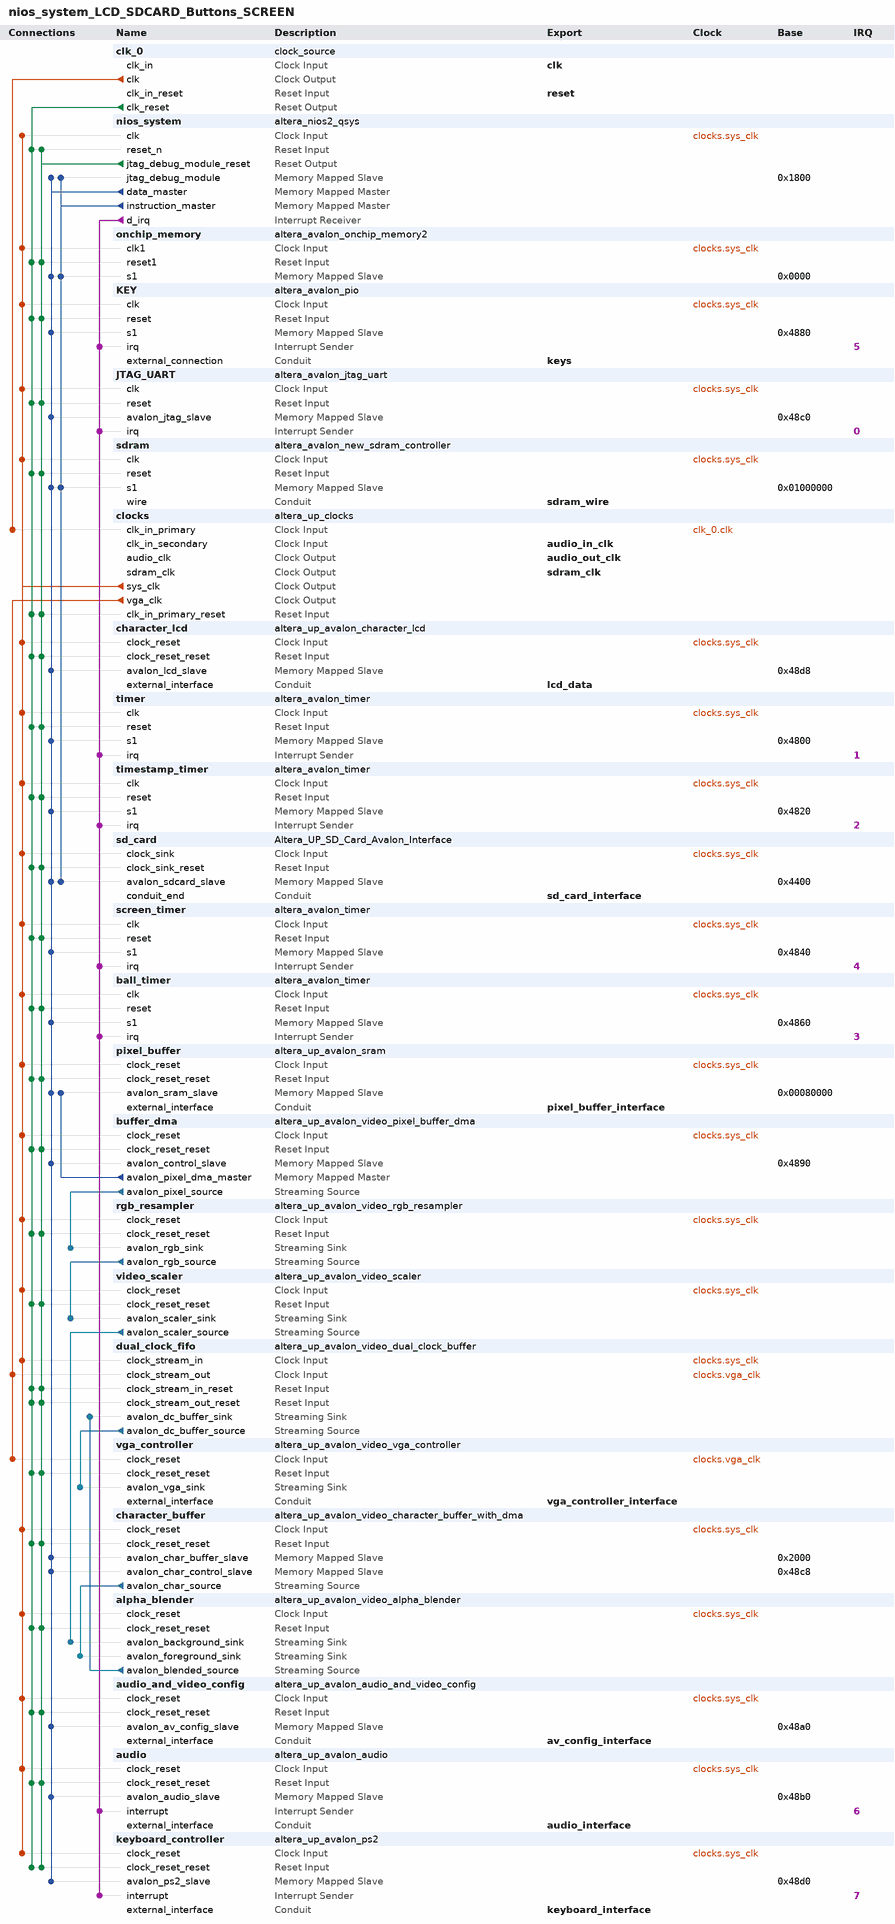
[diagram p0: system contents]
# Platform Designer (Qsys) system nios_system_LCD_SDCARD_Buttons_SCREEN, Cyclone II EP2C35F672C6
# Parameters at their usual value, and those the tool derives, are not listed.
package require -exact qsys 12.0
create_system nios_system_LCD_SDCARD_Buttons_SCREEN
set_project_property DEVICE_FAMILY {Cyclone II}
set_project_property DEVICE EP2C35F672C6

add_instance clk_0 clock_source 12.0
set_instance_parameter_value clk_0 clockFrequency 50000000

add_instance nios_system altera_nios2_qsys 12.0
set_instance_parameter_value nios_system resetSlave sdram.s1
set_instance_parameter_value nios_system exceptionSlave sdram.s1
set_instance_parameter_value nios_system breakSlave nios_system.jtag_debug_module
set_instance_parameter_value nios_system muldiv_multiplierType NoneSmall
set_instance_parameter_value nios_system impl Fast
set_instance_parameter_value nios_system icache_size 4096

add_instance onchip_memory altera_avalon_onchip_memory2 12.0
set_instance_parameter_value onchip_memory dataWidth 32
set_instance_parameter_value onchip_memory dualPort false
set_instance_parameter_value onchip_memory initMemContent true
set_instance_parameter_value onchip_memory initializationFileName onchip_memory
set_instance_parameter_value onchip_memory memorySize 4096

add_instance KEY altera_avalon_pio 12.0
set_instance_parameter_value KEY captureEdge true
set_instance_parameter_value KEY direction Input
set_instance_parameter_value KEY edgeType FALLING
set_instance_parameter_value KEY generateIRQ true
set_instance_parameter_value KEY irqType EDGE
set_instance_parameter_value KEY width 8

add_instance JTAG_UART altera_avalon_jtag_uart 12.0
set_instance_parameter_value JTAG_UART simInteractiveOptions INTERACTIVE_ASCII_OUTPUT

add_instance sdram altera_avalon_new_sdram_controller 12.0
set_instance_parameter_value sdram TAC 5.5
set_instance_parameter_value sdram TRCD 20.0
set_instance_parameter_value sdram TRP 20.0
set_instance_parameter_value sdram casLatency 3
set_instance_parameter_value sdram columnWidth 8
set_instance_parameter_value sdram dataWidth 16
set_instance_parameter_value sdram generateSimulationModel false
set_instance_parameter_value sdram model custom
set_instance_parameter_value sdram numberOfBanks 4
set_instance_parameter_value sdram numberOfChipSelects 1
set_instance_parameter_value sdram powerUpDelay 100.0
set_instance_parameter_value sdram refreshPeriod 15.625
set_instance_parameter_value sdram rowWidth 12

add_instance clocks altera_up_clocks 12.0
set_instance_parameter_value clocks board DE2
set_instance_parameter_value clocks vga_clk true
set_instance_parameter_value clocks audio_clk true
set_instance_parameter_value clocks audio_clk_freq 12.288

add_instance character_lcd altera_up_avalon_character_lcd 12.0
set_instance_parameter_value character_lcd cursor Normal

add_instance timer altera_avalon_timer 12.0
set_instance_parameter_value timer period 1
set_instance_parameter_value timer periodUnits MSEC
set_instance_parameter_value timer timerPreset FULL_FEATURED

add_instance timestamp_timer altera_avalon_timer 12.0
set_instance_parameter_value timestamp_timer period 1
set_instance_parameter_value timestamp_timer periodUnits MSEC
set_instance_parameter_value timestamp_timer timerPreset FULL_FEATURED

add_instance sd_card Altera_UP_SD_Card_Avalon_Interface 1.0

add_instance screen_timer altera_avalon_timer 12.0
set_instance_parameter_value screen_timer period 100
set_instance_parameter_value screen_timer periodUnits MSEC
set_instance_parameter_value screen_timer timerPreset FULL_FEATURED

add_instance ball_timer altera_avalon_timer 12.0
set_instance_parameter_value ball_timer period 200
set_instance_parameter_value ball_timer periodUnits MSEC
set_instance_parameter_value ball_timer timerPreset FULL_FEATURED

add_instance pixel_buffer altera_up_avalon_sram 12.0
set_instance_parameter_value pixel_buffer board DE2
set_instance_parameter_value pixel_buffer pixel_buffer true

add_instance buffer_dma altera_up_avalon_video_pixel_buffer_dma 12.0
set_instance_parameter_value buffer_dma addr_mode X-Y
set_instance_parameter_value buffer_dma start_address 0
set_instance_parameter_value buffer_dma back_start_address 0
set_instance_parameter_value buffer_dma image_width 320
set_instance_parameter_value buffer_dma image_height 240
set_instance_parameter_value buffer_dma color_space {16-bit RGB}

add_instance rgb_resampler altera_up_avalon_video_rgb_resampler 12.0
set_instance_parameter_value rgb_resampler input_type {16-bit RGB}
set_instance_parameter_value rgb_resampler output_type {30-bit RGB}
set_instance_parameter_value rgb_resampler alpha 1023

add_instance video_scaler altera_up_avalon_video_scaler 12.0
set_instance_parameter_value video_scaler width_scaling 2
set_instance_parameter_value video_scaler height_scaling 2
set_instance_parameter_value video_scaler width_in 320
set_instance_parameter_value video_scaler color_bits 10
set_instance_parameter_value video_scaler color_planes 3

add_instance dual_clock_fifo altera_up_avalon_video_dual_clock_buffer 12.0
set_instance_parameter_value dual_clock_fifo color_bits 10

add_instance vga_controller altera_up_avalon_video_vga_controller 12.0
set_instance_parameter_value vga_controller board DE2

add_instance character_buffer altera_up_avalon_video_character_buffer_with_dma 12.0
set_instance_parameter_value character_buffer enable_transparency true

add_instance alpha_blender altera_up_avalon_video_alpha_blender 12.0

add_instance audio_and_video_config altera_up_avalon_audio_and_video_config 12.0
set_instance_parameter_value audio_and_video_config board DE2
set_instance_parameter_value audio_and_video_config audio_in {Microphone to ADC}
set_instance_parameter_value audio_and_video_config line_in_bypass false
set_instance_parameter_value audio_and_video_config bit_length 24
set_instance_parameter_value audio_and_video_config sampling_rate {32 kHz}

add_instance audio altera_up_avalon_audio 12.0
set_instance_parameter_value audio avalon_bus_type {Memory Mapped}
set_instance_parameter_value audio audio_in true
set_instance_parameter_value audio dw 24

add_instance keyboard_controller altera_up_avalon_ps2 12.0

# connections
add_connection clk_0.clk clocks.clk_in_primary clock
add_connection clocks.sys_clk alpha_blender.clock_reset clock
add_connection clocks.sys_clk audio.clock_reset clock
add_connection clocks.sys_clk audio_and_video_config.clock_reset clock
add_connection clocks.sys_clk ball_timer.clk clock
add_connection clocks.sys_clk buffer_dma.clock_reset clock
add_connection clocks.sys_clk character_buffer.clock_reset clock
add_connection clocks.sys_clk character_lcd.clock_reset clock
add_connection clocks.sys_clk dual_clock_fifo.clock_stream_in clock
add_connection clocks.sys_clk JTAG_UART.clk clock
add_connection clocks.sys_clk KEY.clk clock
add_connection clocks.sys_clk keyboard_controller.clock_reset clock
add_connection clocks.sys_clk nios_system.clk clock
add_connection clocks.sys_clk onchip_memory.clk1 clock
add_connection clocks.sys_clk pixel_buffer.clock_reset clock
add_connection clocks.sys_clk rgb_resampler.clock_reset clock
add_connection clocks.sys_clk screen_timer.clk clock
add_connection clocks.sys_clk sd_card.clock_sink clock
add_connection clocks.sys_clk sdram.clk clock
add_connection clocks.sys_clk timer.clk clock
add_connection clocks.sys_clk timestamp_timer.clk clock
add_connection clocks.sys_clk video_scaler.clock_reset clock
add_connection clocks.vga_clk dual_clock_fifo.clock_stream_out clock
add_connection clocks.vga_clk vga_controller.clock_reset clock
add_connection clk_0.clk_reset alpha_blender.clock_reset_reset reset
add_connection clk_0.clk_reset audio.clock_reset_reset reset
add_connection clk_0.clk_reset audio_and_video_config.clock_reset_reset reset
add_connection clk_0.clk_reset ball_timer.reset reset
add_connection clk_0.clk_reset buffer_dma.clock_reset_reset reset
add_connection clk_0.clk_reset character_buffer.clock_reset_reset reset
add_connection clk_0.clk_reset character_lcd.clock_reset_reset reset
add_connection clk_0.clk_reset clocks.clk_in_primary_reset reset
add_connection clk_0.clk_reset dual_clock_fifo.clock_stream_in_reset reset
add_connection clk_0.clk_reset dual_clock_fifo.clock_stream_out_reset reset
add_connection clk_0.clk_reset JTAG_UART.reset reset
add_connection clk_0.clk_reset KEY.reset reset
add_connection clk_0.clk_reset keyboard_controller.clock_reset_reset reset
add_connection clk_0.clk_reset nios_system.reset_n reset
add_connection clk_0.clk_reset onchip_memory.reset1 reset
add_connection clk_0.clk_reset pixel_buffer.clock_reset_reset reset
add_connection clk_0.clk_reset rgb_resampler.clock_reset_reset reset
add_connection clk_0.clk_reset screen_timer.reset reset
add_connection clk_0.clk_reset sd_card.clock_sink_reset reset
add_connection clk_0.clk_reset sdram.reset reset
add_connection clk_0.clk_reset timer.reset reset
add_connection clk_0.clk_reset timestamp_timer.reset reset
add_connection clk_0.clk_reset vga_controller.clock_reset_reset reset
add_connection clk_0.clk_reset video_scaler.clock_reset_reset reset
add_connection nios_system.jtag_debug_module_reset alpha_blender.clock_reset_reset reset
add_connection nios_system.jtag_debug_module_reset audio.clock_reset_reset reset
add_connection nios_system.jtag_debug_module_reset audio_and_video_config.clock_reset_reset reset
add_connection nios_system.jtag_debug_module_reset ball_timer.reset reset
add_connection nios_system.jtag_debug_module_reset buffer_dma.clock_reset_reset reset
add_connection nios_system.jtag_debug_module_reset character_buffer.clock_reset_reset reset
add_connection nios_system.jtag_debug_module_reset character_lcd.clock_reset_reset reset
add_connection nios_system.jtag_debug_module_reset clocks.clk_in_primary_reset reset
add_connection nios_system.jtag_debug_module_reset dual_clock_fifo.clock_stream_in_reset reset
add_connection nios_system.jtag_debug_module_reset dual_clock_fifo.clock_stream_out_reset reset
add_connection nios_system.jtag_debug_module_reset JTAG_UART.reset reset
add_connection nios_system.jtag_debug_module_reset KEY.reset reset
add_connection nios_system.jtag_debug_module_reset keyboard_controller.clock_reset_reset reset
add_connection nios_system.jtag_debug_module_reset nios_system.reset_n reset
add_connection nios_system.jtag_debug_module_reset onchip_memory.reset1 reset
add_connection nios_system.jtag_debug_module_reset pixel_buffer.clock_reset_reset reset
add_connection nios_system.jtag_debug_module_reset rgb_resampler.clock_reset_reset reset
add_connection nios_system.jtag_debug_module_reset screen_timer.reset reset
add_connection nios_system.jtag_debug_module_reset sd_card.clock_sink_reset reset
add_connection nios_system.jtag_debug_module_reset sdram.reset reset
add_connection nios_system.jtag_debug_module_reset timer.reset reset
add_connection nios_system.jtag_debug_module_reset timestamp_timer.reset reset
add_connection nios_system.jtag_debug_module_reset vga_controller.clock_reset_reset reset
add_connection nios_system.jtag_debug_module_reset video_scaler.clock_reset_reset reset
add_connection buffer_dma.avalon_pixel_dma_master pixel_buffer.avalon_sram_slave avalon
set_connection_parameter_value buffer_dma.avalon_pixel_dma_master/pixel_buffer.avalon_sram_slave baseAddress 0x00080000
add_connection nios_system.data_master audio.avalon_audio_slave avalon
set_connection_parameter_value nios_system.data_master/audio.avalon_audio_slave baseAddress 0x48b0
add_connection nios_system.data_master audio_and_video_config.avalon_av_config_slave avalon
set_connection_parameter_value nios_system.data_master/audio_and_video_config.avalon_av_config_slave baseAddress 0x48a0
add_connection nios_system.data_master ball_timer.s1 avalon
set_connection_parameter_value nios_system.data_master/ball_timer.s1 baseAddress 0x4860
add_connection nios_system.data_master buffer_dma.avalon_control_slave avalon
set_connection_parameter_value nios_system.data_master/buffer_dma.avalon_control_slave baseAddress 0x4890
add_connection nios_system.data_master character_buffer.avalon_char_buffer_slave avalon
set_connection_parameter_value nios_system.data_master/character_buffer.avalon_char_buffer_slave baseAddress 0x2000
add_connection nios_system.data_master character_buffer.avalon_char_control_slave avalon
set_connection_parameter_value nios_system.data_master/character_buffer.avalon_char_control_slave baseAddress 0x48c8
add_connection nios_system.data_master character_lcd.avalon_lcd_slave avalon
set_connection_parameter_value nios_system.data_master/character_lcd.avalon_lcd_slave baseAddress 0x48d8
add_connection nios_system.data_master JTAG_UART.avalon_jtag_slave avalon
set_connection_parameter_value nios_system.data_master/JTAG_UART.avalon_jtag_slave baseAddress 0x48c0
add_connection nios_system.data_master KEY.s1 avalon
set_connection_parameter_value nios_system.data_master/KEY.s1 baseAddress 0x4880
add_connection nios_system.data_master keyboard_controller.avalon_ps2_slave avalon
set_connection_parameter_value nios_system.data_master/keyboard_controller.avalon_ps2_slave baseAddress 0x48d0
add_connection nios_system.data_master nios_system.jtag_debug_module avalon
set_connection_parameter_value nios_system.data_master/nios_system.jtag_debug_module baseAddress 0x1800
add_connection nios_system.data_master onchip_memory.s1 avalon
set_connection_parameter_value nios_system.data_master/onchip_memory.s1 baseAddress 0x0000
add_connection nios_system.data_master pixel_buffer.avalon_sram_slave avalon
set_connection_parameter_value nios_system.data_master/pixel_buffer.avalon_sram_slave baseAddress 0x00080000
add_connection nios_system.data_master screen_timer.s1 avalon
set_connection_parameter_value nios_system.data_master/screen_timer.s1 baseAddress 0x4840
add_connection nios_system.data_master sd_card.avalon_sdcard_slave avalon
set_connection_parameter_value nios_system.data_master/sd_card.avalon_sdcard_slave baseAddress 0x4400
add_connection nios_system.data_master sdram.s1 avalon
set_connection_parameter_value nios_system.data_master/sdram.s1 baseAddress 0x01000000
add_connection nios_system.data_master timer.s1 avalon
set_connection_parameter_value nios_system.data_master/timer.s1 baseAddress 0x4800
add_connection nios_system.data_master timestamp_timer.s1 avalon
set_connection_parameter_value nios_system.data_master/timestamp_timer.s1 baseAddress 0x4820
add_connection nios_system.instruction_master nios_system.jtag_debug_module avalon
set_connection_parameter_value nios_system.instruction_master/nios_system.jtag_debug_module baseAddress 0x1800
add_connection nios_system.instruction_master onchip_memory.s1 avalon
set_connection_parameter_value nios_system.instruction_master/onchip_memory.s1 baseAddress 0x0000
add_connection nios_system.instruction_master sd_card.avalon_sdcard_slave avalon
set_connection_parameter_value nios_system.instruction_master/sd_card.avalon_sdcard_slave baseAddress 0x4400
add_connection nios_system.instruction_master sdram.s1 avalon
set_connection_parameter_value nios_system.instruction_master/sdram.s1 baseAddress 0x01000000
add_connection alpha_blender.avalon_blended_source dual_clock_fifo.avalon_dc_buffer_sink avalon_streaming
add_connection buffer_dma.avalon_pixel_source rgb_resampler.avalon_rgb_sink avalon_streaming
add_connection character_buffer.avalon_char_source alpha_blender.avalon_foreground_sink avalon_streaming
add_connection dual_clock_fifo.avalon_dc_buffer_source vga_controller.avalon_vga_sink avalon_streaming
add_connection rgb_resampler.avalon_rgb_source video_scaler.avalon_scaler_sink avalon_streaming
add_connection video_scaler.avalon_scaler_source alpha_blender.avalon_background_sink avalon_streaming
add_connection nios_system.d_irq audio.interrupt interrupt
set_connection_parameter_value nios_system.d_irq/audio.interrupt irqNumber 6
add_connection nios_system.d_irq ball_timer.irq interrupt
set_connection_parameter_value nios_system.d_irq/ball_timer.irq irqNumber 3
add_connection nios_system.d_irq JTAG_UART.irq interrupt
set_connection_parameter_value nios_system.d_irq/JTAG_UART.irq irqNumber 0
add_connection nios_system.d_irq KEY.irq interrupt
set_connection_parameter_value nios_system.d_irq/KEY.irq irqNumber 5
add_connection nios_system.d_irq keyboard_controller.interrupt interrupt
set_connection_parameter_value nios_system.d_irq/keyboard_controller.interrupt irqNumber 7
add_connection nios_system.d_irq screen_timer.irq interrupt
set_connection_parameter_value nios_system.d_irq/screen_timer.irq irqNumber 4
add_connection nios_system.d_irq timer.irq interrupt
set_connection_parameter_value nios_system.d_irq/timer.irq irqNumber 1
add_connection nios_system.d_irq timestamp_timer.irq interrupt
set_connection_parameter_value nios_system.d_irq/timestamp_timer.irq irqNumber 2

# exported interfaces
add_interface clk clock sink
set_interface_property clk EXPORT_OF clk_0.clk_in
add_interface reset reset sink
set_interface_property reset EXPORT_OF clk_0.clk_in_reset
add_interface sdram_wire conduit end
set_interface_property sdram_wire EXPORT_OF sdram.wire
add_interface sdram_clk clock source
set_interface_property sdram_clk EXPORT_OF clocks.sdram_clk
add_interface keys conduit end
set_interface_property keys EXPORT_OF KEY.external_connection
add_interface lcd_data conduit end
set_interface_property lcd_data EXPORT_OF character_lcd.external_interface
add_interface sd_card_interface conduit end
set_interface_property sd_card_interface EXPORT_OF sd_card.conduit_end
add_interface pixel_buffer_interface conduit end
set_interface_property pixel_buffer_interface EXPORT_OF pixel_buffer.external_interface
add_interface vga_controller_interface conduit end
set_interface_property vga_controller_interface EXPORT_OF vga_controller.external_interface
add_interface av_config_interface conduit end
set_interface_property av_config_interface EXPORT_OF audio_and_video_config.external_interface
add_interface audio_in_clk clock sink
set_interface_property audio_in_clk EXPORT_OF clocks.clk_in_secondary
add_interface audio_out_clk clock source
set_interface_property audio_out_clk EXPORT_OF clocks.audio_clk
add_interface audio_interface conduit end
set_interface_property audio_interface EXPORT_OF audio.external_interface
add_interface keyboard_interface conduit end
set_interface_property keyboard_interface EXPORT_OF keyboard_controller.external_interface

save_system nios_system_LCD_SDCARD_Buttons_SCREEN.qsys
